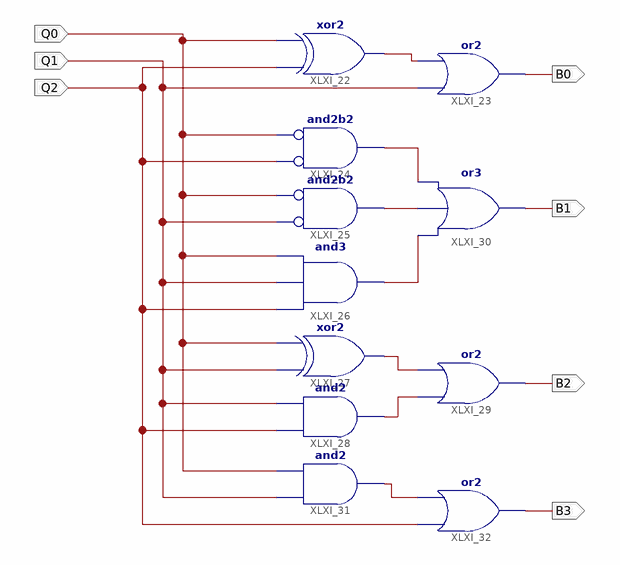
[diagram p0: schematic sheet 1]
// Xilinx ISE schematic dekoderL2.sch (spartan3e) as structural Verilog: 11 symbols, 7 ports
module dekoderL2 (
  input  Q0,
  input  Q1,
  input  Q2,
  output B3,
  output B2,
  output B1,
  output B0
);

  wire XLXN_57, XLXN_62, XLXN_63, XLXN_64, XLXN_65, XLXN_66, XLXN_67;

  xor XLXI_22 (XLXN_57, Q2, Q0);
  or XLXI_23 (B0, Q1, XLXN_57);
  and XLXI_24 (XLXN_66, ~Q2, ~Q0);  // and2b2
  and XLXI_25 (XLXN_65, ~Q1, ~Q0);  // and2b2
  and XLXI_26 (XLXN_64, Q2, Q1, Q0);
  xor XLXI_27 (XLXN_63, Q1, Q0);
  and XLXI_28 (XLXN_62, Q2, Q1);
  or XLXI_29 (B2, XLXN_62, XLXN_63);
  or XLXI_30 (B1, XLXN_64, XLXN_65, XLXN_66);
  and XLXI_31 (XLXN_67, Q1, Q0);
  or XLXI_32 (B3, Q2, XLXN_67);
endmodule
